# Altium schematic sheet DVP.SchDoc
size A4; DocumentNumber: 9; SheetNumber: 9; SheetTotal: 15
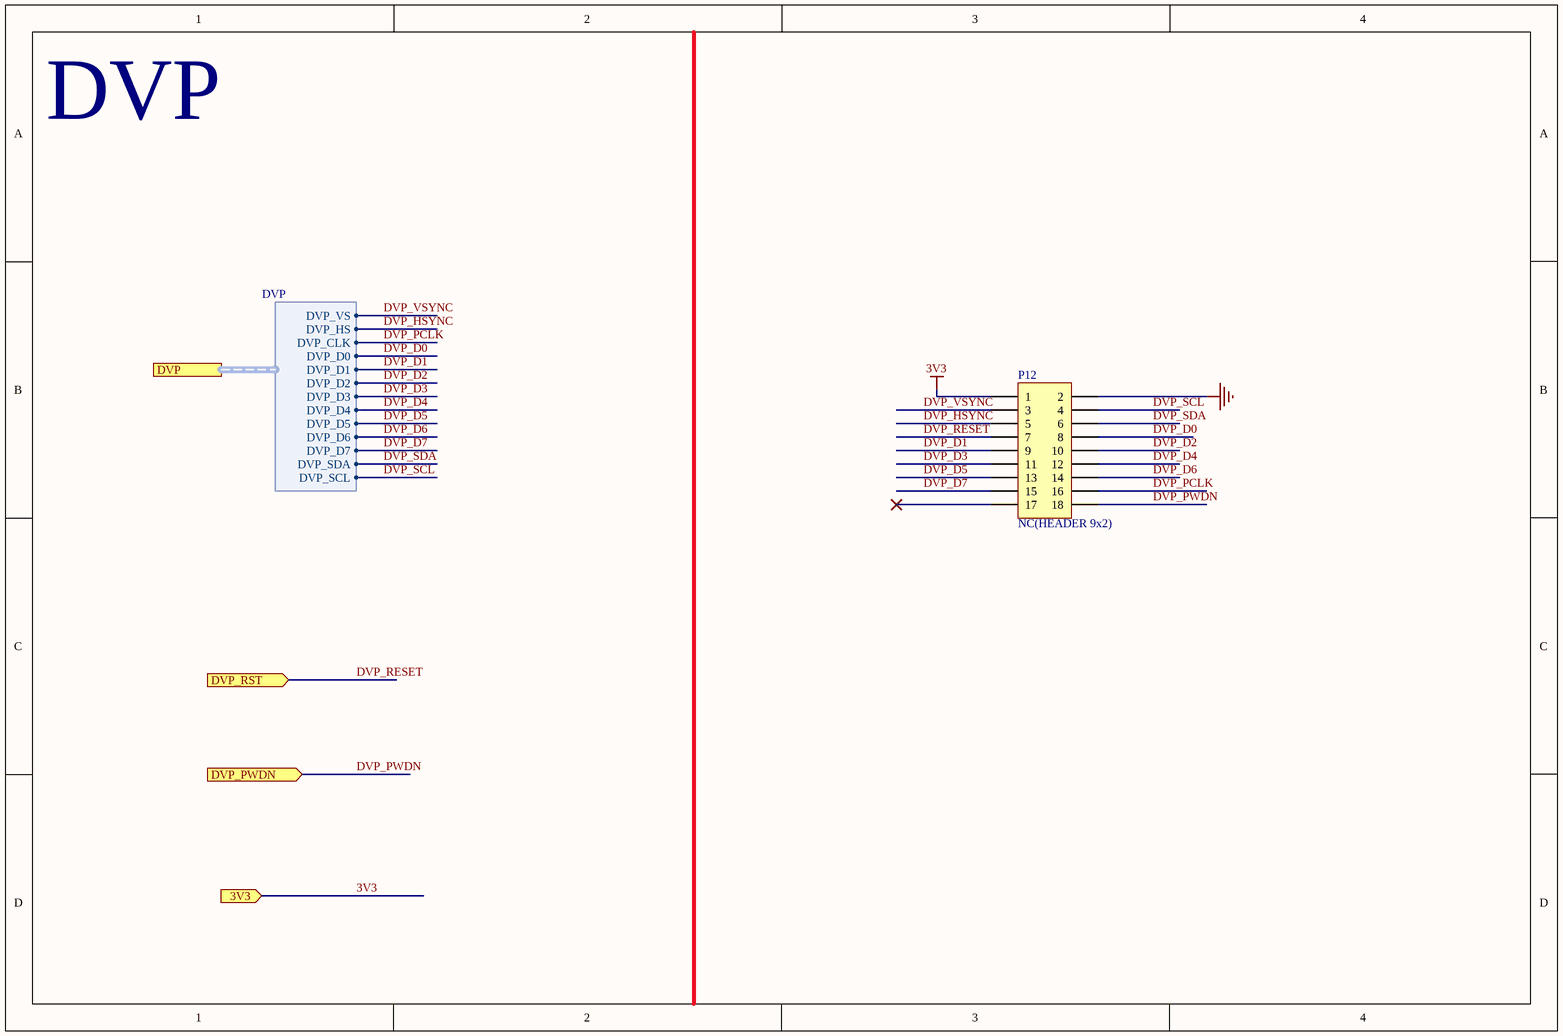
[diagram p0: DVP.SchDoc]

## Parts
P12  NC(HEADER 9x2)  [IDC18-2.54MM]

## Ports
3V3 (in), DVP (harness DVP), DVP_PWDN (in), DVP_RST (in)

## Harnesses
DVP: DVP_VS, DVP_HS, DVP_CLK, DVP_D0, DVP_D1, DVP_D2, DVP_D3, DVP_D4, DVP_D5, DVP_D6, DVP_D7, DVP_SDA, DVP_SCL

## Nets
3V3: P12.1 ; port 3V3
GND: P12.2
DVP_D0: P12.8 ; port DVP.DVP_D0
DVP_D1: P12.9 ; port DVP.DVP_D1
DVP_D2: P12.10 ; port DVP.DVP_D2
DVP_D3: P12.11 ; port DVP.DVP_D3
DVP_D4: P12.12 ; port DVP.DVP_D4
DVP_D5: P12.13 ; port DVP.DVP_D5
DVP_D6: P12.14 ; port DVP.DVP_D6
DVP_D7: P12.15 ; port DVP.DVP_D7
DVP_HSYNC: P12.5 ; port DVP.DVP_HS
DVP_PCLK: P12.16 ; port DVP.DVP_CLK
DVP_PWDN: P12.18 ; port DVP_PWDN
DVP_RESET: P12.7 ; port DVP_RST
DVP_SCL: P12.4 ; port DVP.DVP_SCL
DVP_SDA: P12.6 ; port DVP.DVP_SDA
DVP_VSYNC: P12.3 ; port DVP.DVP_VS

Not connected (* = marked no-connect by the designer): P12 17*

## Notes on the sheet
- DVP

## Library data of the parts
P12 = HEADER 9x2: Header, 9-Pin, Dual row